# EAGLE design soccerbot (EAGLE 9.2.2)

## Sheet 1 of 5
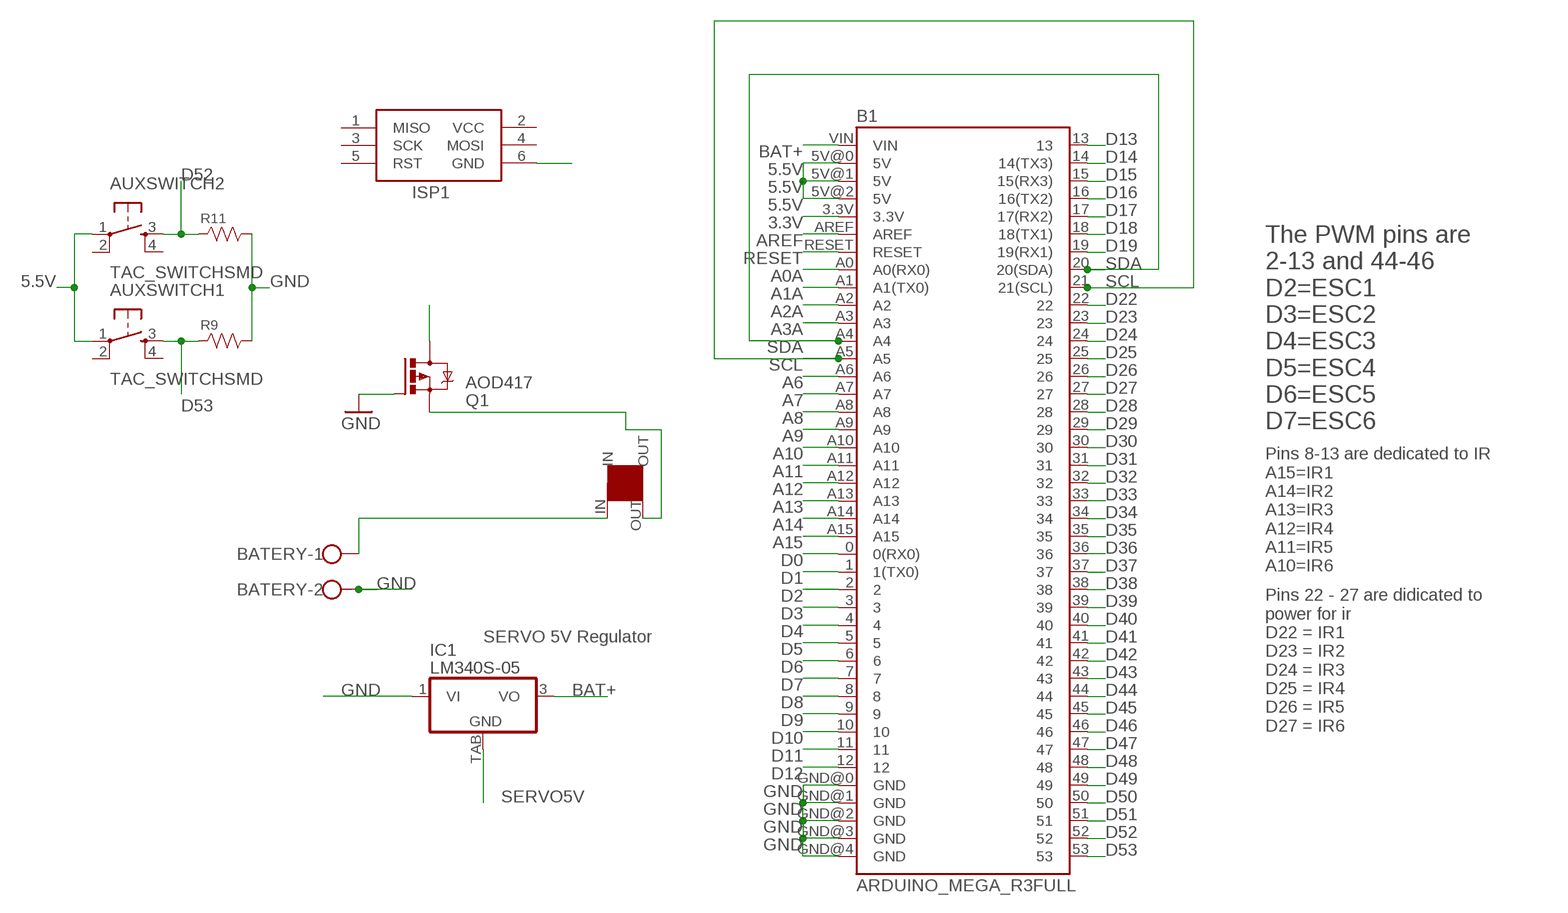
[diagram p0: schematic, sheet 1]

### Parts
AUXSWITCH1  TAC_SWITCHSMD  [TACTILE-SWITCH-SMD]
AUXSWITCH2  TAC_SWITCHSMD  [TACTILE-SWITCH-SMD]
B1  ARDUINO_MEGA_R3FULL  [ARDUINO_MEGA]
BATERY  W237-102  [W237-102]
IC1  LM340S-05  [TO263-3]
ISP1  AVRISP-6  [AVRISP]
Q1  AOD417  IRFR5305  [D-PAK_TO252AA]
R9  RESISTOR-0603  [0603]
R11  RESISTOR-0603  [0603]
U$2  TOGGLESWITCH  [TOGGLESWITCH]

### Nets
3.3V: B1.3.3V ; also sheet 2
5.5V: AUXSWITCH1.1 AUXSWITCH2.1 B1.5V@0(5V) B1.5V@1(5V) B1.5V@2(5V) ; also sheet 2,3,4
A0A: B1.A0(A0(RX0))
A1A: B1.A1(A1(TX0))
A2A: B1.A2
A3A: B1.A3
A6: B1.A6 ; also sheet 2
A7: B1.A7
A8: B1.A8 ; also sheet 2
A9: B1.A9
A10: B1.A10 ; also sheet 2
A11: B1.A11 ; also sheet 2
A12: B1.A12 ; also sheet 2
A13: B1.A13 ; also sheet 2
A14: B1.A14 ; also sheet 2
A15: B1.A15 ; also sheet 2
AREF: B1.AREF
BAT+ [hipower]: B1.VIN IC1.3(VO) Q1.4(D) ; also sheet 2,4
D0: B1.0(0(RX0))
D1: B1.1(1(TX0))
D2: B1.2 ; also sheet 4
D3: B1.3 ; also sheet 4
D4: B1.4 ; also sheet 4
D5: B1.5 ; also sheet 4
D6: B1.6 ; also sheet 4
D7: B1.7 ; also sheet 4
D8: B1.8
D9: B1.9
D10: B1.10
D11: B1.11
D12: B1.12
D13: B1.13
D14: B1.14(14(TX3))
D15: B1.15(15(RX3))
D16: B1.16(16(TX2))
D17: B1.17(17(RX2))
D18: B1.18(18(TX1))
D19: B1.19(19(RX1))
D22: B1.22
D23: B1.23
D24: B1.24
D25: B1.25
D26: B1.26
D27: B1.27
D28: B1.28
D29: B1.29
D30: B1.30
D31: B1.31
D32: B1.32
D33: B1.33
D34: B1.34
D35: B1.35
D36: B1.36
D37: B1.37
D38: B1.38
D39: B1.39
D40: B1.40
D41: B1.41
D42: B1.42
D43: B1.43
D44: B1.44
D45: B1.45
D46: B1.46
D47: B1.47
D48: B1.48
D49: B1.49
D50: B1.50
D51: B1.51
D52: AUXSWITCH2.3 B1.52 R11.1
D53: AUXSWITCH1.3 B1.53 R9.1
GND: B1.GND@0(GND) B1.GND@1(GND) B1.GND@2(GND) B1.GND@3(GND) B1.GND@4(GND) BATERY.2 IC1.1(VI) ISP1.6(GND) Q1.1(G) R9.2 R11.2 ; also sheet 2,3,4
N$4 [hipower]: BATERY.1 U$2.IN
N$5 [hipower]: Q1.3(S) U$2.OUT
RESET: B1.RESET
SCL: B1.21(21(SCL)) B1.A5 ; also sheet 2,3
SDA: B1.20(20(SDA)) B1.A4 ; also sheet 2,3
SERVO5V [lopower]: IC1.TAB(GND)
Unconnected: AUXSWITCH1.2 AUXSWITCH1.4 AUXSWITCH2.2 AUXSWITCH2.4 ISP1.1(MISO) ISP1.3(SCK) ISP1.4(MOSI) ISP1.5(RST)

### Notes on the sheet
- The PWM pins are
  2-13 and 44-46
  D2=ESC1
  D3=ESC2
  D4=ESC3
  D5=ESC4
  D6=ESC5
  D7=ESC6
- Pins 8-13 are dedicated to IR
  A15=IR1
  A14=IR2
  A13=IR3
  A12=IR4
  A11=IR5
  A10=IR6
- SERVO 5V Regulator
- Pins 22 - 27 are didicated to
  power for ir
  D22 = IR1
  D23 = IR2
  D24 = IR3
  D25 = IR4
  D26 = IR5
  D27 = IR6

## Sheet 2 of 5
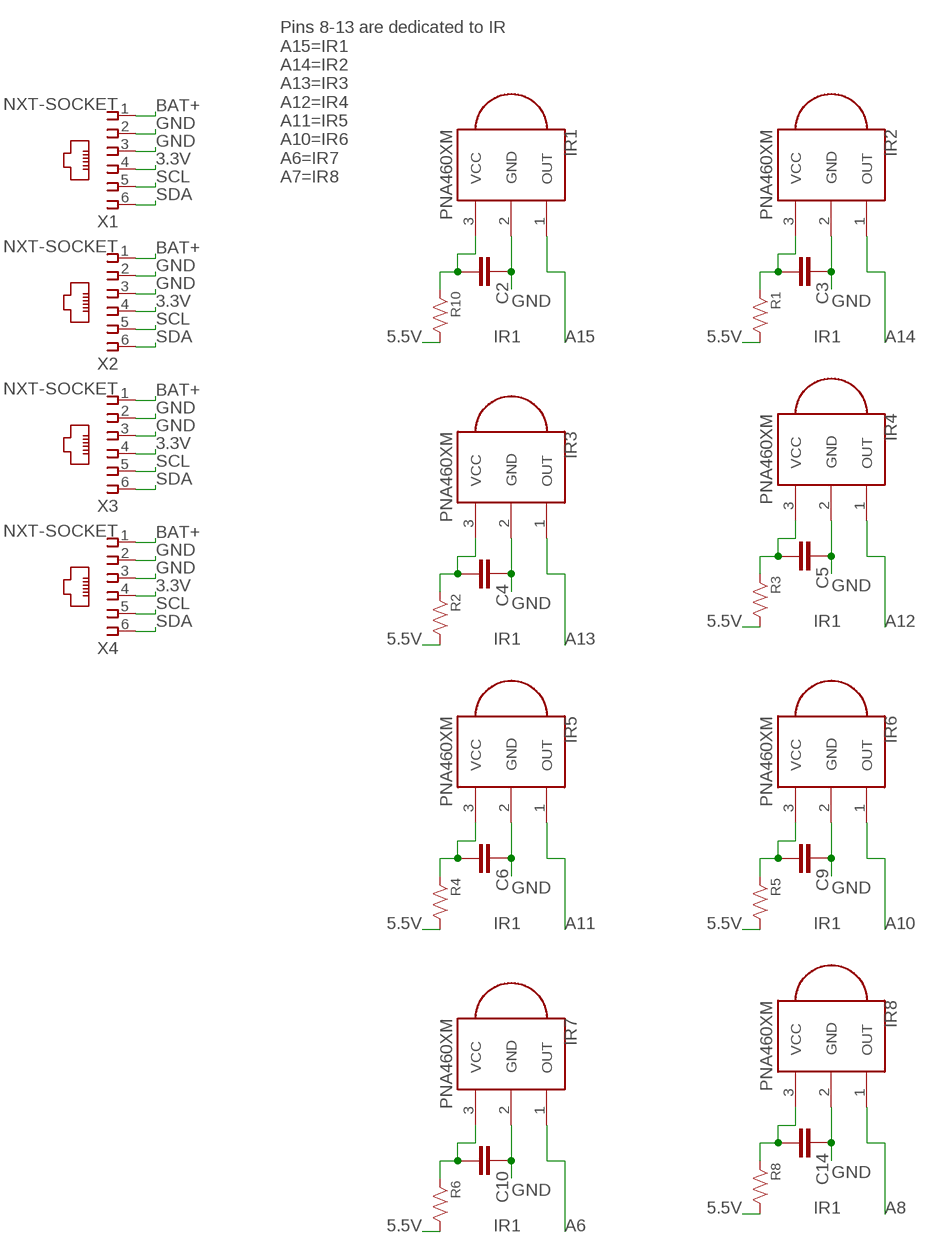
[diagram p1: schematic, sheet 2]

### Parts
C2  CAPACITOR  [C0603]
C3  CAPACITOR  [C0603]
C4  CAPACITOR  [C0603]
C5  CAPACITOR  [C0603]
C6  CAPACITOR  [C0603]
C9  CAPACITOR  [C0603]
C10  CAPACITOR  [C0603]
C14  CAPACITOR  [C0603]
IR1  PNA460XM  [PNA460XM]
IR2  PNA460XM  [PNA460XM]
IR3  PNA460XM  [PNA460XM]
IR4  PNA460XM  [PNA460XM]
IR5  PNA460XM  [PNA460XM]
IR6  PNA460XM  [PNA460XM]
IR7  PNA460XM  [PNA460XM]
IR8  PNA460XM  [PNA460XM]
R1  RESISTOR-0603-NARROW  [0603-NARROW]
R2  RESISTOR-0603-NARROW  [0603-NARROW]
R3  RESISTOR-0603-NARROW  [0603-NARROW]
R4  RESISTOR-0603-NARROW  [0603-NARROW]
R5  RESISTOR-0603-NARROW  [0603-NARROW]
R6  RESISTOR-0603-NARROW  [0603-NARROW]
R8  RESISTOR-0603-NARROW  [0603-NARROW]
R10  RESISTOR-0603-NARROW  [0603-NARROW]
X1  NXT-SOCKET  [NXT-SOCKET]
X2  NXT-SOCKET  [NXT-SOCKET]
X3  NXT-SOCKET  [NXT-SOCKET]
X4  NXT-SOCKET  [NXT-SOCKET]

### Nets
3.3V: X1.4 X2.4 X3.4 X4.4 ; also sheet 1
5.5V: R1.2 R2.2 R3.2 R4.2 R5.2 R6.2 R8.2 R10.2 ; also sheet 1,3,4
A6: IR7.1(OUT) ; also sheet 1
A8: IR8.1(OUT) ; also sheet 1
A10: IR6.1(OUT) ; also sheet 1
A11: IR5.1(OUT) ; also sheet 1
A12: IR4.1(OUT) ; also sheet 1
A13: IR3.1(OUT) ; also sheet 1
A14: IR2.1(OUT) ; also sheet 1
A15: IR1.1(OUT) ; also sheet 1
BAT+ [hipower]: X1.1 X2.1 X3.1 X4.1 ; also sheet 1,4
GND: C2.1 C3.1 C4.1 C5.1 C6.1 C9.1 C10.1 C14.1 IR1.2(GND) IR2.2(GND) IR3.2(GND) IR4.2(GND) IR5.2(GND) IR6.2(GND) IR7.2(GND) IR8.2(GND) X1.2 X1.3 X2.2 X2.3 X3.2 X3.3 X4.2 X4.3 ; also sheet 1,3,4
N$2: C3.2 IR2.3(VCC) R1.1
N$6: C2.2 IR1.3(VCC) R10.1
N$7: C4.2 IR3.3(VCC) R2.1
N$8: C5.2 IR4.3(VCC) R3.1
N$9: C6.2 IR5.3(VCC) R4.1
N$10: C9.2 IR6.3(VCC) R5.1
N$11: C10.2 IR7.3(VCC) R6.1
N$12: C14.2 IR8.3(VCC) R8.1
SCL: X1.5 X2.5 X3.5 X4.5 ; also sheet 1,3
SDA: X1.6 X2.6 X3.6 X4.6 ; also sheet 1,3

### Notes on the sheet
- Pins 8-13 are dedicated to IR
  A15=IR1
  A14=IR2
  A13=IR3
  A12=IR4
  A11=IR5
  A10=IR6
  A6=IR7
  A7=IR8
- IR1 | IR1
- IR1
- IR1
- IR1 | IR1
- IR1
- IR1

## Sheet 3 of 5
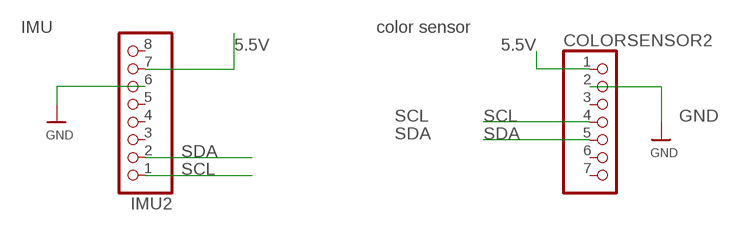
[diagram p2: schematic, sheet 3]

### Parts
COLORSENSOR2  HEADER-1X770MIL  [1X07_ROUND_70]
IMU2  HEADER-1X876MIL  [1X08_ROUND_76]

### Nets
5.5V: COLORSENSOR2.1 IMU2.7 ; also sheet 1,2,4
GND: COLORSENSOR2.2 IMU2.6 ; also sheet 1,2,4
SCL: COLORSENSOR2.4 IMU2.1 ; also sheet 1,2
SDA: COLORSENSOR2.5 IMU2.2 ; also sheet 1,2
Unconnected: COLORSENSOR2.3 COLORSENSOR2.6 COLORSENSOR2.7 IMU2.3 IMU2.4 IMU2.5 IMU2.8

### Notes on the sheet
- IMU | color sensor

## Sheet 4 of 5
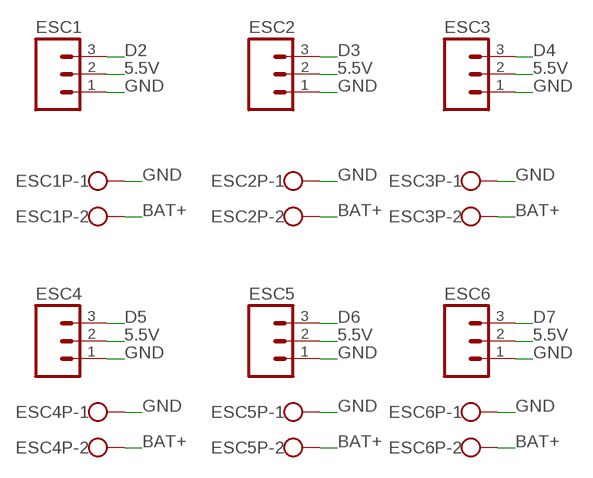
[diagram p3: schematic, sheet 4]

### Parts
ESC1  M03LOCK  [1X03_LOCK]
ESC1P  W237-102  [W237-102]
ESC2  M03LOCK  [1X03_LOCK]
ESC2P  W237-102  [W237-102]
ESC3  M03LOCK  [1X03_LOCK]
ESC3P  W237-102  [W237-102]
ESC4  M03LOCK  [1X03_LOCK]
ESC4P  W237-102  [W237-102]
ESC5  M03LOCK  [1X03_LOCK]
ESC5P  W237-102  [W237-102]
ESC6  M03LOCK  [1X03_LOCK]
ESC6P  W237-102  [W237-102]

### Nets
5.5V: ESC1.2 ESC2.2 ESC3.2 ESC4.2 ESC5.2 ESC6.2 ; also sheet 1,2,3
BAT+ [hipower]: ESC1P.2 ESC2P.2 ESC3P.2 ESC4P.2 ESC5P.2 ESC6P.2 ; also sheet 1,2
D2: ESC1.3 ; also sheet 1
D3: ESC2.3 ; also sheet 1
D4: ESC3.3 ; also sheet 1
D5: ESC4.3 ; also sheet 1
D6: ESC5.3 ; also sheet 1
D7: ESC6.3 ; also sheet 1
GND: ESC1.1 ESC1P.1 ESC2.1 ESC2P.1 ESC3.1 ESC3P.1 ESC4.1 ESC4P.1 ESC5.1 ESC5P.1 ESC6.1 ESC6P.1 ; also sheet 1,2,3

## Sheet 5 of 5
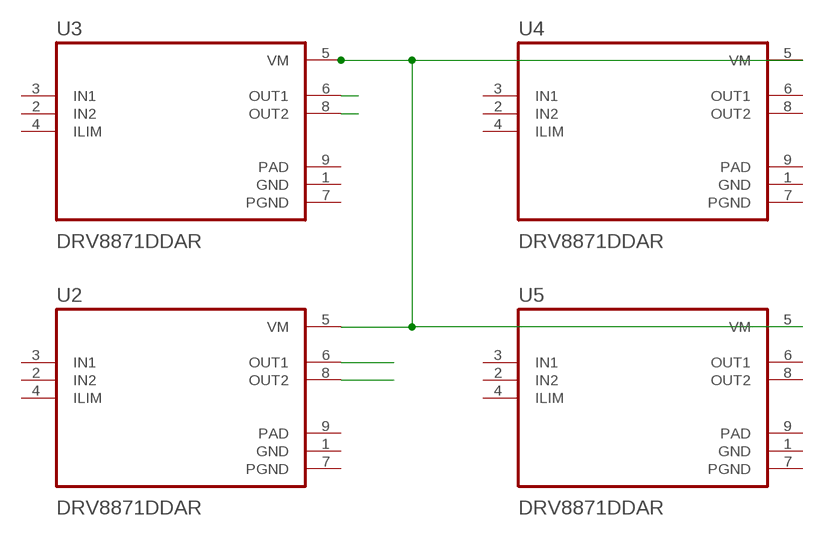
[diagram p4: schematic, sheet 5]

### Parts
U2  DRV8871DDAR  [SOIC127P600X170-8N]
U3  DRV8871DDAR  [SOIC127P600X170-8N]
U4  DRV8871DDAR  [SOIC127P600X170-8N]
U5  DRV8871DDAR  [SOIC127P600X170-8N]

### Nets
N$1: U2.5(VM) U3.5(VM) U4.5(VM) U5.5(VM)
N$3: U3.6(OUT1)
N$13: U3.8(OUT2)
N$15: U2.6(OUT1)
N$16: U2.8(OUT2)
Unconnected: U2.2(IN2) U2.3(IN1) U2.4(ILIM) U3.2(IN2) U3.3(IN1) U3.4(ILIM) U4.2(IN2) U4.3(IN1) U4.4(ILIM) U4.6(OUT1) U4.8(OUT2) U5.2(IN2) U5.3(IN1) U5.4(ILIM) U5.6(OUT1) U5.8(OUT2)

## Power pins joined to a net without a drawn wire
5.5V: ISP1.2(VCC)
GND: U2.1(GND) U3.1(GND) U4.1(GND) U5.1(GND)
PAD: U2.9(PAD) U3.9(PAD) U4.9(PAD) U5.9(PAD)
PGND: U2.7(PGND) U3.7(PGND) U4.7(PGND) U5.7(PGND)

## Library data of the parts
AUXSWITCH1 AUXSWITCH2 = SparkFun-Retired:TAC_SWITCH: Momentary Switch Button commonly used for reset or general input. Spark Fun Electronics SKU : COM-00097 SMT- SWCH-08247; PROD_ID: SWCH-08247
B1 = SparkFun-Boards:ARDUINO_MEGA_R3: Arduino Mega R3 ATmega2560 R3 compatible footprint. SparkFun Products: Arduino Mega 2560 R3 <https://www.sparkfun.com/products/11061>; OC_NEWARK: unknown
BATERY ESC1P ESC2P ESC3P ESC4P ESC5P ESC6P = con-wago-500:W237-102: WAGO SCREW CLAMP; MPN: MA522-500M02; OC_FARNELL: unknown; OC_NEWARK: 04R6830
C2-C6 C9 C10 C14 = BaseApp:CAPACITOR
COLORSENSOR2 = microbuilder:HEADER-1X7: PIN HEADER; OC_NEWARK: unknown
ESC1-ESC6 = SparkFun:M03: Header 3 Standard 3-pin 0.1" header. Use with straight break away headers (SKU : PRT-00116), right angle break away headers (PRT-00553), swiss pins (PRT-00743), machine pins (PRT-00117), and female headers (PRT-00115). Molex polarized connector foot print use with SKU : PRT-08232 with associated crimp pins and housings.; MF: MOLEX; MPN: 22-11-2032; OC_NEWARK: 81C8218
IC1 = linear:LM340?-*: Positive VOLTAGE REGULATOR Source: http://cache.national.com/ds/LM/LM340.pdf; MPN: LM1085ISX-5.0/NOPB; OC_NEWARK: 01AC5221
IMU2 = microbuilder:HEADER-1X8: PIN HEADER; OC_NEWARK: unknown
IR1-IR8 = adafruit:PNA460XM: IR 38KHz receiver PNA4602 and related receivers http://www.ladyada.net/library/pcb/eaglelibrary.html
ISP1 = adafruit:AVRISP: AVR ISP HEADER Standard 6 pin header for AVR programming; OC_NEWARK: unknown
Q1 = transistor-power:IRF?5305: HEXFET Power MOSFET Source: http://www.irf.com/product-info/datasheets/data/irfr5305pbf.pdf; MPN: AUIRFR540ZTRL; OC_NEWARK: 91Y4154
R1-R6 R8-R11 = FaBo-Resistors:RESISTOR: RESISTOR
U2-U5 = DRV8871DDAR:DRV8871DDAR: 3.6A Brushed DC Motor Driver with Integrated Current Sensing (PWM Ctrl) 8-SO PowerPAD -40 to 125; AVAILABILITY: Unavailable; DESCRIPTION: 3.6A Brushed DC Motor Driver with Integrated Current Sensing _PWM Ctrl_ 8-SO PowerPAD -40 to 125; MF: Texas Instruments; MP: DRV8871DDAR; PACKAGE: SO-8 Texas Instruments; PRICE: None
U$2 = toggleswitch:TOGGLESWITCH
X1-X4 = NXT Compatible (female) Sockets - Mindsensors:NXT-SOCKET: RJ11 6 connects Manufacturer: Mindsensors.com Source: NXT-Female-Socket.pdf; MPN: RJE01-660-01; OC_FARNELL: unknown; OC_NEWARK: 01M6133

## Net classes
0 default: width 0.508 mm, clearance 0.206 mm
1 hipower: width 1.651 mm, clearance 0.206 mm
2 lopower: width 0.762 mm, clearance 0.206 mm
3 signal: width 0.254 mm, clearance 0.206 mm

## Board
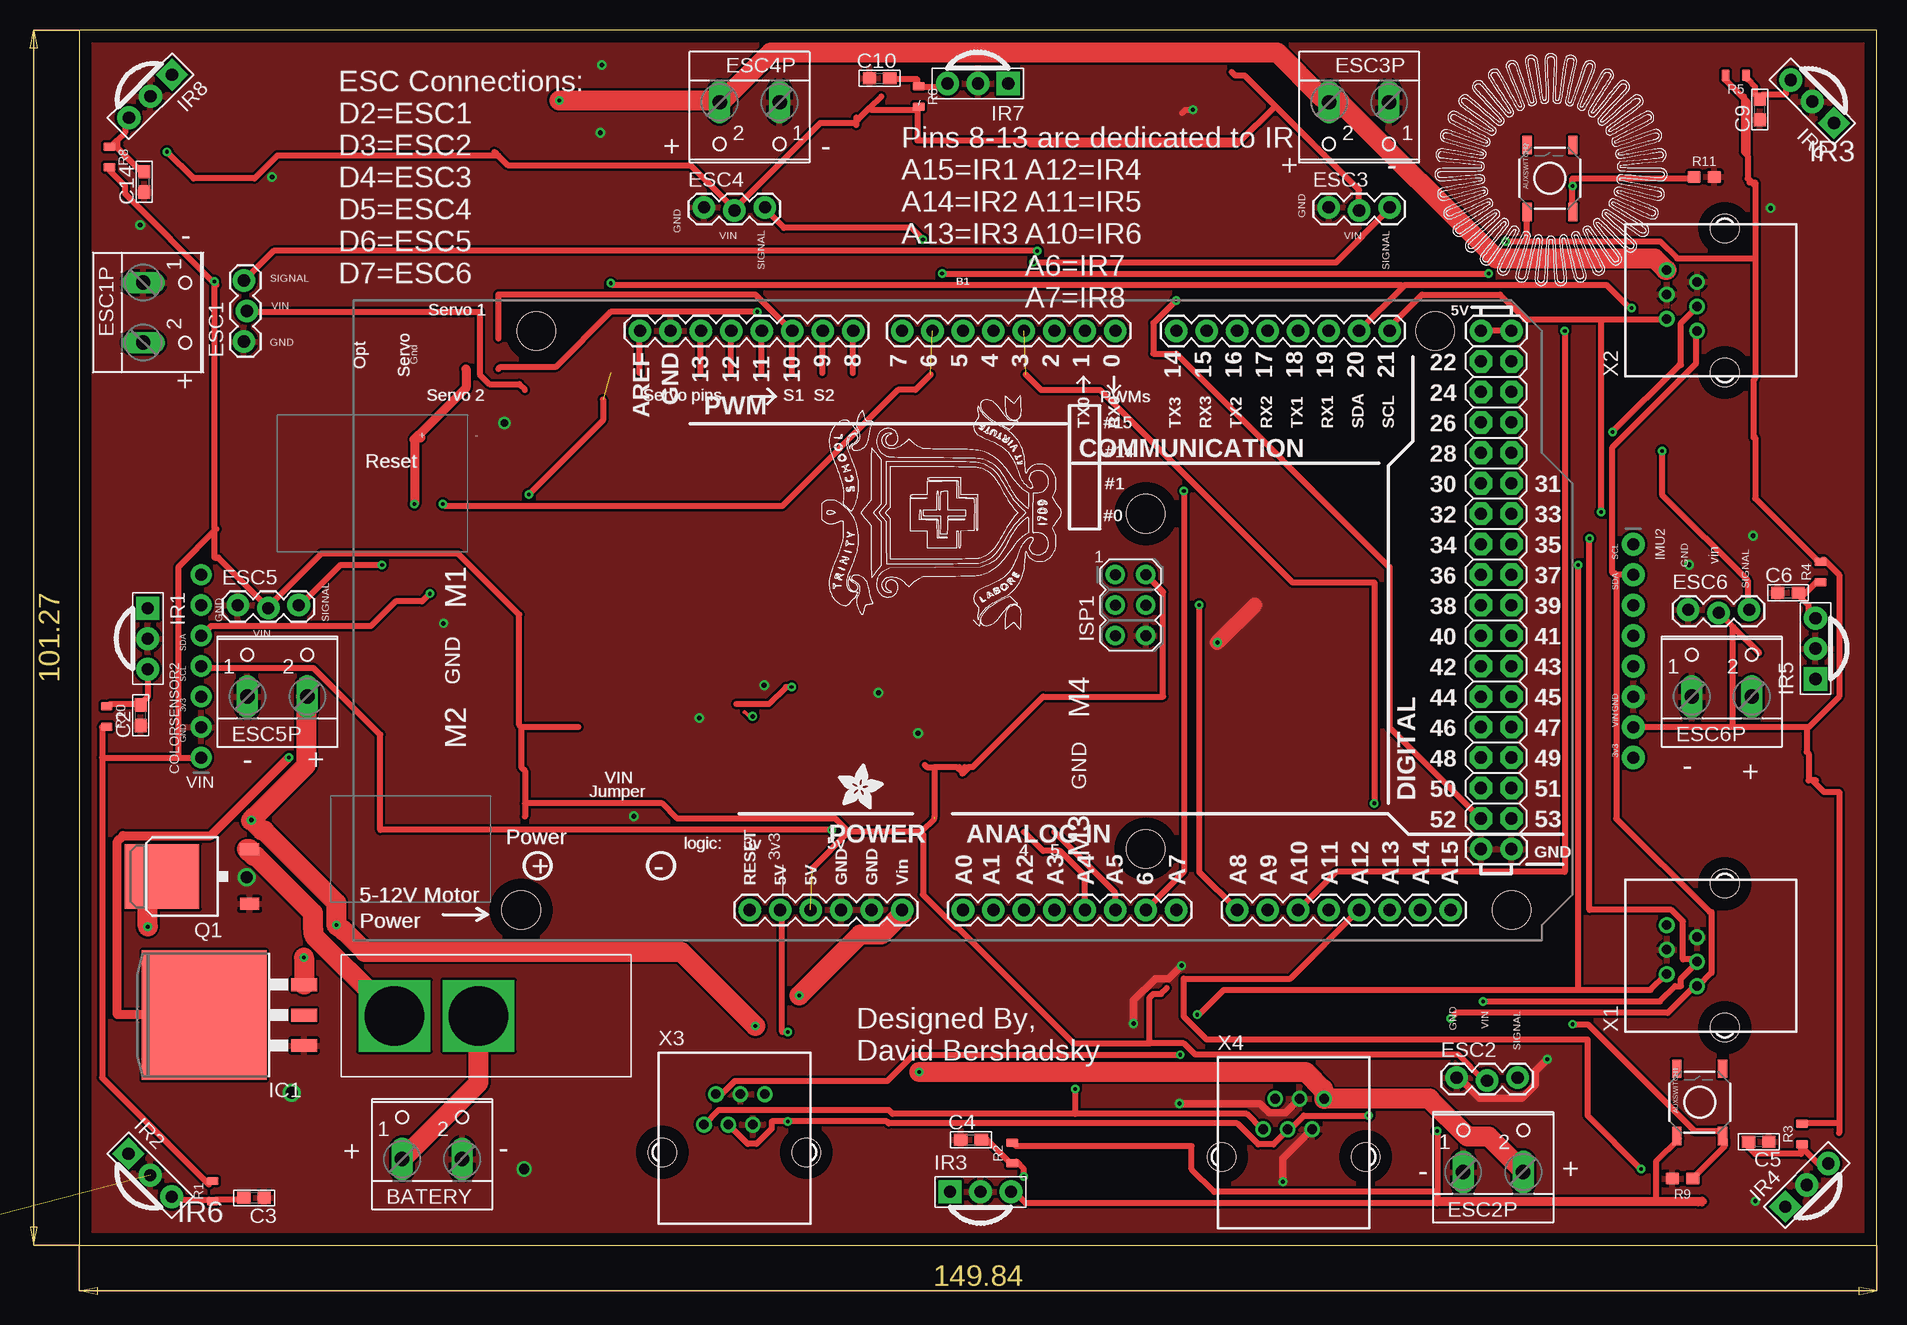
[diagram p5: board, top side]
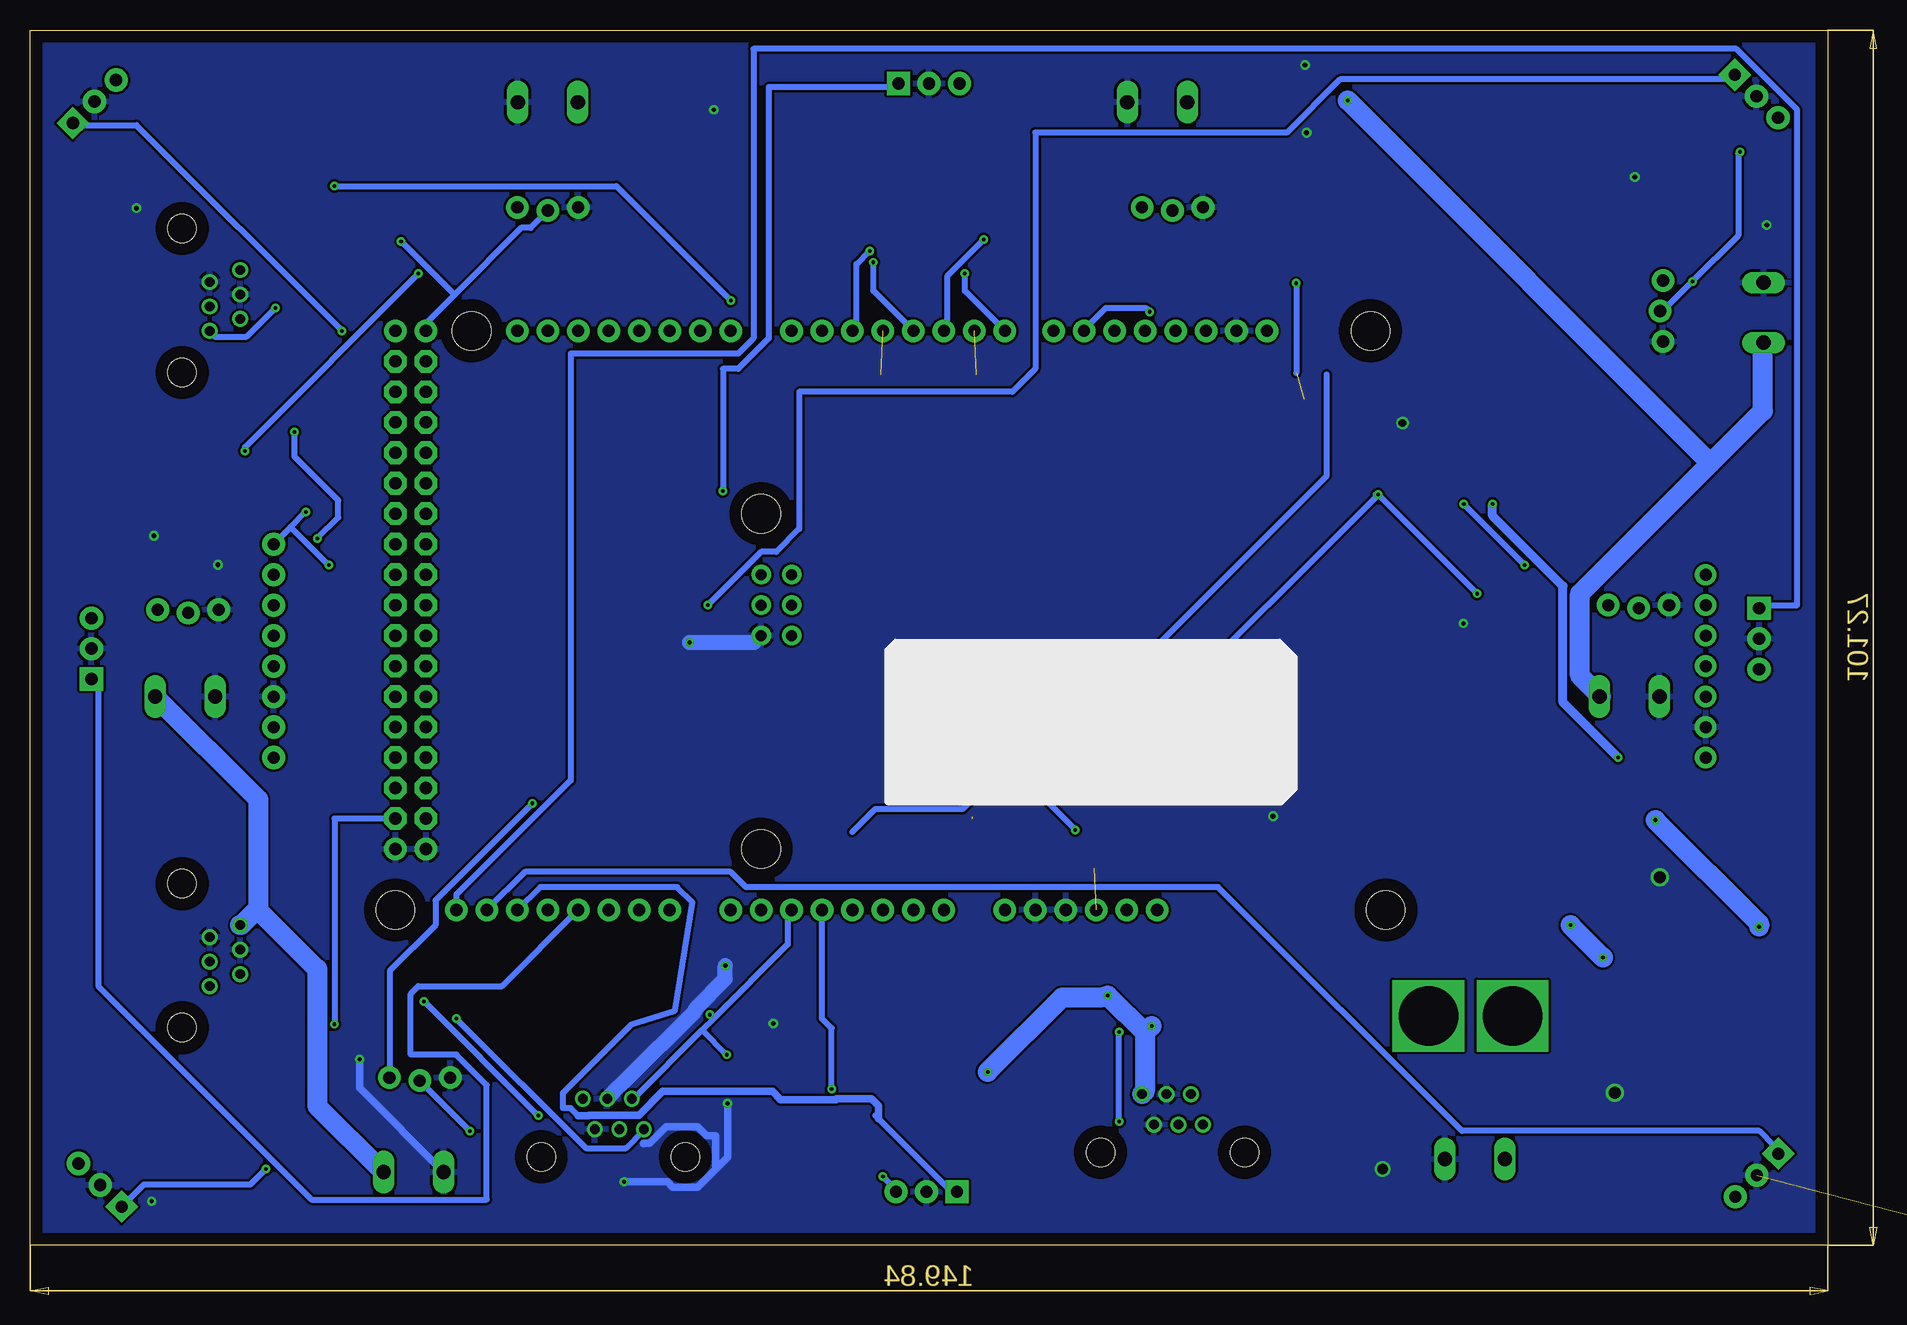
[diagram p6: board, bottom side, seen from below]

Size 149.84 x 101.27 mm. Coordinates in mm from the lower left corner, seen from the top.
Outline: 0,0 149.84,0 149.84,101.27 0,101.27 0,0
Copper layers (1*16): Top 0.035mm / dielectric 1.5mm / Bottom 0.035mm
Design rules "PcbWay *": minimum track width 6mil, minimum drill 0.3mm, track to track 0.205mm, track to pad 0.205mm, pad to pad 0.205mm, via to via 0.205mm, smd to smd 8mil, copper to edge 40mil, drill to drill 0.300228125mm, minimum pad ring 10mil, minimum via ring 8mil, stop-mask expansion 4mil, vias tented up to drill 25mil, thermal gap 10mil

### Footprints (pad centres in the part's own frame; a part is rotated, then mirrored left to right if it is on the bottom)
TACTILE-SWITCH-SMD = smd 1.524 x 0.762: 1 -2.794,1.905; 2 2.794,1.905; 3 -2.794,-1.905; 4 2.794,-1.905
ARDUINO_MEGA = drill 1.016 pad 1.88: 0 13.97,24.13; 1 11.43,24.13; 2 8.89,24.13; 3 6.35,24.13; 3.3V -13.97,-24.13; 4 3.81,24.13; 5 1.27,24.13; 5V@0 -11.43,-24.13; 5V@1 44.45,24.13; 5V@2 46.99,24.13; 6 -1.27,24.13; 7 -3.81,24.13; 8 -7.874,24.13; 9 -10.414,24.13; 10 -12.954,24.13; 11 -15.494,24.13; 12 -18.034,24.13; 13 -20.574,24.13; 14 19.05,24.13; 15 21.59,24.13; 16 24.13,24.13; 17 26.67,24.13; 18 29.21,24.13; 19 31.75,24.13; 20 34.29,24.13; 21 36.83,24.13; A0 1.27,-24.13; A1 3.81,-24.13; A2 6.35,-24.13; A3 8.89,-24.13; A4 11.43,-24.13; A5 13.97,-24.13; A6 16.51,-24.13; A7 19.05,-24.13; A8 24.13,-24.13; A9 26.67,-24.13; A10 29.21,-24.13; A11 31.75,-24.13; A12 34.29,-24.13; A13 36.83,-24.13; A14 39.37,-24.13; A15 41.91,-24.13; AREF -25.654,24.13; GND@0 -8.89,-24.13; GND@1 -6.35,-24.13; GND@2 44.45,-19.05; GND@3 46.99,-19.05; GND@4 -23.114,24.13; RESET -16.51,-24.13; VIN -3.81,-24.13 | drill 1.016 pad 1.88 octagon: 22 44.45,21.59; 23 46.99,21.59; 24 44.45,19.05; 25 46.99,19.05; 26 44.45,16.51; 27 46.99,16.51; 28 44.45,13.97; 29 46.99,13.97; 30 44.45,11.43; 31 46.99,11.43; 32 44.45,8.89; 33 46.99,8.89; 34 44.45,6.35; 35 46.99,6.35; 36 44.45,3.81; 37 46.99,3.81; 38 44.45,1.27; 39 46.99,1.27; 40 44.45,-1.27; 41 46.99,-1.27; 42 44.45,-3.81; 43 46.99,-3.81; 44 44.45,-6.35; 45 46.99,-6.35; 46 44.45,-8.89; 47 46.99,-8.89; 48 44.45,-11.43; 49 46.99,-11.43; 50 44.45,-13.97; 51 46.99,-13.97; 52 44.45,-16.51; 53 46.99,-16.51 | hole 3.2: -34.29,24.13; -35.56,-24.13; 16.51,8.89; 16.51,-19.05; 40.64,24.13; 46.99,-24.13
W237-102 = drill 1.194 long: 1 -2.5,-1.27; 2 2.5,-1.27
C0603 = smd 1.1 x 1: 1 -0.85,0; 2 0.85,0
1X07_ROUND_70 = drill 1 pad 1.778: 1 -7.62,0; 2 -5.08,0; 3 -2.54,0; 4 0,0; 5 2.54,0; 6 5.08,0; 7 7.62,0
1X03_LOCK = drill 1.016 pad 1.88: 1 0,0.127; 2 2.54,-0.127; 3 5.08,0.127
TO263-3 = smd 1.067 x 2.159: 1 -2.54,-5.791; 2 0,-5.791; 3 2.54,-5.791 | smd 10.8 x 10.41: TAB 0,2.54
1X08_ROUND_76 = drill 1 pad 1.93: 1 -8.89,0; 2 -6.35,0; 3 -3.81,0; 4 -1.27,0; 5 1.27,0; 6 3.81,0; 7 6.35,0; 8 8.89,0
PNA460XM = drill 1.016 pad 1.93 square: 1 -2.54,0 | drill 1.016 pad 1.93: 2 0,0; 3 2.54,0
AVRISP = drill 0.9 pad 1.626: 1 -1.27,2.54; 2 1.27,2.54; 3 -1.27,0; 4 1.27,0; 5 -1.27,-2.54; 6 1.27,-2.54
D-PAK_TO252AA = smd 1 x 1.6: 1 -2.28,-4.8; 3 2.28,-4.8 | smd 5.4 x 6.2: 4 0,2.5
0603-NARROW = smd 0.71 x 1: 1 -0.85,0; 2 0.85,0
0603 = smd 1.1 x 1: 1 -0.85,0; 2 0.85,0
SOIC127P600X170-8N = smd 1.97 x 0.6: 1 -2.475,1.905; 2 -2.475,0.635; 3 -2.475,-0.635; 4 -2.475,-1.905; 5 2.475,-1.905; 6 2.475,-0.635; 7 2.475,0.635; 8 2.475,1.905 | smd 2.02 x 2.87: 9 0,0
TOGGLESWITCH = drill 4.953 square: IN 0,0; OUT 0,-7.01
NXT-SOCKET = drill 0.8 pad 1.3: 1 2.54,4.84; 2 1.54,2.3; 3 0.5,4.84; 4 -0.5,2.3; 5 -1.54,4.84; 6 -2.54,2.3 | hole 2.36: -6,0; 6,0

### Placement (x,y rotation side)
AUXSWITCH1  135.06,11.91 90 top
AUXSWITCH2  122.59,88.9 90 top
B1  72.39,52.07 0 top
BATERY  29.4,8.45 0 top
C2  5.11,44.16 90 top
C3  14.57,3.94 180 top
C4  74.33,8.79 0 top
C5  139.99,8.64 180 top
C6  142.43,54.39 0 top
C9  140.08,94.65 90 top
C10  66.71,97.25 0 top
C14  5.4,88.61 90 top
COLORSENSOR2  10.16,48.26 90 top
ESC1  13.84,75.31 90 top
ESC1P  6.6,77.72 270 top
ESC2  114.81,13.84 0 top
ESC2P  117.86,7.37 0 top
ESC3  104.14,86.36 0 top
ESC3P  106.68,93.98 180 top
ESC4  52.07,86.36 0 top
ESC4P  55.88,93.98 180 top
ESC5  13.21,53.21 0 top
ESC5P  16.51,46.99 0 top
ESC6  134.11,52.83 0 top
ESC6P  136.91,46.99 0 top
IC1  12.95,19.18 90 top
IMU2  129.54,49.53 270 top
IR1  5.71,50.55 270 top
IR2  5.9,5.84 315 top
IR3  75.12,4.45 0 top
IR4  144,5.02 45 top
IR5  144.72,49.72 90 top
IR6  144.46,95.31 135 top
IR7  74.9,96.81 180 top
IR8  5.93,95.75 225 top
ISP1  87.63,53.34 0 top
Q1  9.4,30.73 90 top
R1  11.11,4.51 90 top
R2  77.76,7.68 90 top
R3  143.61,9.27 90 top
R4  145.13,56.1 90 top
R5  138.08,97.5 180 top
R6  69.98,95.73 270 top
R8  2.51,90.68 270 top
R9  133.64,5.56 180 top
R10  2.29,44.07 270 top
R11  135.45,89.03 0 top
U2  -10.73,-1.08 0 top  (outside the outline)
U3  -19.49,-1.08 0 top  (outside the outline)
U4  -28.26,-1.08 0 top  (outside the outline)
U5  -37.02,-1.08 0 top  (outside the outline)
U$2  33.27,19.11 270 top
U$17  [ADAFRUIT_TEXT_30MM]  77.98,38.1 0 bottom
U$18  [ADAFRUIT_3.5MM]  63.25,36.32 0 top
X1  137.16,24.13 90 top
X2  137.16,78.74 90 top
X3  54.61,7.75 0 top
X4  101.22,7.37 0 top

### Tracks (layer width: path | path; a pad name or v marks a point on that pad's centre or on a via)
3.3V  (via drill 0.3)
  Top 0.508: v117,20.32 131.76,20.32 133.03,21.59 133.51,21.59 133.51,22.23 134.78,23.5 X1.4 134.78,23.81 133.67,23.81 133.67,26.99 132.72,27.94 125.89,27.94 v125.89,58.9 | v107.47,10.79 102.08,10.79 100.97,9.68 X4.4 100.65,9.53 99.54,8.41 98.27,8.41 96.52,10.16 67.47,10.16 67.31,10.32 v59.05,10.32 57.72,10.32 57.72,9.72 56.45,8.45 55.71,8.45 X3.4 | v127.79,67.79 133.35,73.34 133.51,73.34 133.51,76.83 134.78,78.11 X2.4 | v59.05,17.78 58.58,17.78 58.58,27.78 B1.3.3V
  Bottom 0.508: v107.47,10.79 v117,20.32 | v127.79,67.79 127.79,65.72 124.14,62.07 124.14,60.64 v125.89,58.9 | v59.05,10.32 v59.05,17.78
5.5V  (via drill 0.3)  (2 unrouted)
  Top 0.152: 73.59,39.3 73.6,39.29
  Top 0.508: 139.06,90.81 139.06,88.9 139.7,88.27 | 139.06,90.81 138.75,91.12 138.75,95.73 | 139.7,88.27 139.7,88.58 139.22,88.58 | 139.7,88.27 139.7,82.23 | 139.7,82.23 139.7,72.23 139.54,72.07 139.54,67.31 139.7,67.31 139.7,62.23 144.78,57.15 R4.2 145.41,57.15 146.69,55.88 146.69,45.72 144.15,43.18 143.99,43.18 | B1.5V@2 B1.5V@1 | 96.04,97.79 96.36,97.47 97.16,97.47 99.69,94.93 | 99.69,94.93 106.68,87.95 ESC3.2 | 139.7,82.23 133.19,82.23 131.76,83.66 120.65,83.66 | v118.9,83.66 120.65,83.66 | 37.15,71.28 36.67,71.75 34.16,71.75 33.37,72.55 33.37,77.79 13.97,77.79 ESC1.2 | 66.83,95.73 65.88,94.77 | 65.88,94.77 64.93,93.82 64.77,93.98 64.77,93.5 | 64.77,93.5 61.75,93.5 54.61,86.36 ESC4.2 54.45,86.52 50.96,90.01 35.72,90.01 34.92,90.81 | v7.3,91.12 9.53,88.9 14.61,88.9 16.51,90.81 34.92,90.81 | 34.61,91.12 34.92,90.81 | 96.68,91.92 96.52,91.76 79.22,91.76 | 96.68,91.92 99.69,94.93 | 135.25,3.49 135.41,3.65 135.25,3.81 131.44,3.81 | 143.99,43.18 143.99,41.12 144.15,40.96 144.15,38.73 144.78,38.73 144.62,38.58 | 140.02,49.37 137.87,51.51 | 137.87,51.51 136.68,52.7 ESC6.2 | 143.99,43.18 137.79,43.18 | 137.79,43.18 IMU2.7 | 146.69,10.16 146.69,37.78 145.41,37.78 144.62,38.58 | 146.69,10.16 146.69,9.37 | 144.46,38.73 144.62,38.58 | 77.95,4.45 78.9,3.49 113.19,3.49 | 134.94,3.49 113.19,3.49 | 90.65,21.43 90.17,20.95 89.53,20.95 89.22,20.64 89.22,16.83 | 89.22,16.83 92.08,16.83 93.03,15.88 114.94,15.88 117,13.81 117.32,13.81 ESC2.2 | 37.15,36.83 37.15,39.53 36.83,39.85 36.83,43.18 | 37.15,36.83 37.15,35.72 | 41.59,43.18 36.83,43.18 | 71.28,39.85 70.64,39.85 70.48,40.01 | 73.15,39.85 73.34,39.85 | 73.15,39.85 71.28,39.85
  Top 0.508: 71.28,39.85 71.28,35.72 | ISP1.2 90.33,54.45 90.33,45.72 80.33,45.72 74.45,39.85 74.15,39.85 | 73.82,39.85 74.15,39.85 | 64.14,34.45 61.12,31.43 | 70.17,34.45 64.14,34.45 | 71.28,35.56 70.17,34.45 | 37.15,36.83 48.58,36.83 49.85,35.56 63.02,35.56 64.14,34.45 | 89.22,16.83 82.87,16.83 73.18,26.51 73.03,26.51 70.33,29.21 70.33,34.29 70.17,34.45 | 36.83,43.18 36.67,43.34 36.67,52.55 31.59,57.63 20.16,57.63 15.88,53.34 ESC5.2 15.72,53.18 11.59,57.31 11.27,57.31 11.27,59.69 | v113.19,9.53 113.19,4.45 | 113.19,4.45 113.19,3.81 | 113.19,3.81 113.19,3.49 | 11.27,59.69 v11.27,80.33 11.43,80.01 3.81,87.63 3.81,88.27 2.54,89.53 R8.2 | 74.15,39.85 73.6,39.29 73.6,39.4 73.15,39.85 | 113.19,3.81 131.44,3.81 | 113.03,3.81 113.19,3.81 | 64.77,93.34 64.77,93.5 | 146.69,10.16 143.51,10.16 R3.2 | 137.79,43.18 137.79,51.44 137.87,51.51 | 139.06,90.81 139.06,95.25 137.16,97.16 R5.2 | 120.65,83.66 120.65,85.72 AUXSWITCH2.1 | 1.91,40.64 1.91,43.18 R10.2 | 1.91,40.64 1.91,13.97 10.79,5.08 R1.2 | 1.91,40.64 8.26,40.64 | 8.26,40.64 COLORSENSOR2.1 | 113.19,4.45 94.61,4.45 92.71,6.35 92.71,8.26 78.11,8.26 R2.2 | 69.85,94.61 66.04,94.61 65.88,94.77 | 131.44,3.81 131.44,6.99 133.35,8.89 AUXSWITCH1.1 | 8.26,40.64 8.26,56.52 11.43,59.69 11.27,59.69 | 69.85,94.61 69.85,92.08 96.52,92.08 96.68,91.92 | 69.85,94.61 R6.2
  Bottom 0.508: B1.5V@1 116.84,76.83 114.46,79.22 | 114.46,79.22 108.9,84.77 108.11,84.77 106.68,86.2 ESC3.2 | 114.46,79.22 v118.9,83.66 | ESC1.2 13.97,77.95 13.65,77.95 v11.27,80.33 7.46,84.14 7.46,90.96 v7.3,91.12 | v113.19,9.53 117.32,13.65 ESC2.2
A6  (via drill 0.3)
  Top 0.508: B1.A6 92.08,31.11 v92.08,62.87
  Bottom 0.508: v92.08,62.87 92.08,73.03 90.81,73.03 88.27,75.56 88.27,96.52 77.47,96.52 IR7.1
A8  (via drill 0.3)
  Top 0.508: B1.A8 93.34,31.11 v93.34,53.34
  Bottom 0.508: v93.34,53.34 88.9,57.78 87.63,57.78 85.72,59.69 85.72,71.12 67.94,71.12 66.04,73.03 66.04,92.71 45.09,92.71 40.64,97.16 8.26,97.16 IR8.1
A10  (via drill 0.3)
  Top 0.508: B1.A10 104.78,31.11 123.83,31.11 v123.83,76.2
  Bottom 0.508: v123.83,76.2 140.97,93.34 146.05,93.34 IR6.1
A11
  Bottom 0.508: B1.A11 110.49,21.59 117.47,21.59 118.11,20.95 118.11,15.88 114.3,15.88 111.76,13.34 111.76,3.81 126.36,3.81 144.15,21.59 144.15,46.99 IR5.1
A12  (via drill 0.3)
  Top 0.508: B1.A12 100.97,22.23 92.08,22.23 92.08,19.05 93.98,17.14 125.73,17.14 125.73,10.79 v130.18,6.35
  Bottom 0.508: v130.18,6.35 131.44,5.08 140.34,5.08 141.6,3.81 IR4.1
A13
  Bottom 0.508: B1.A13 107.31,29.84 95.89,29.84 94.61,28.57 96.08,19.56 99.69,18.41 105.41,12.7 105.41,11.43 104.78,11.43 104.14,10.79 | 79.38,10.79 79.12,10.54 73.03,4.45 IR3.1
  Bottom 0.635: 79.12,10.54 79.12,11.62 79.69,12.19 82.61,12.19 82.66,12.14 87.26,12.14 87.95,12.83 97.09,12.83 99.08,10.84 103.25,10.84 103.3,10.79 104.14,10.79
A14
  Bottom 0.508: B1.A14 108.58,31.11 91.44,31.11 90.17,29.84 50.8,29.84 30.48,9.53 5.71,9.53 4.45,8.26 IR2.1
A15
  Bottom 0.508: B1.A15 114.3,29.21 104.78,38.73 104.78,74.3 90.81,74.3 89.53,75.56 89.53,99.69 7.62,99.69 2.54,94.61 2.54,53.34 5.71,53.34 IR1.1
AREF
  Top 0.508: 46.67,72.71 46.67,76.2 B1.AREF
BAT+  (via drill 0.3, 0.35)
  Top 1.651: X2.1 132.24,81.28 131.29,82.23 118.11,82.23 105.09,95.25 ESC3P.2 103.5,95.73 99.85,99.38 57.63,99.38 53.5,95.25 ESC4P.2 52.7,95.41 v40.01,95.41 | 103.82,12.22 112.55,12.22 115.73,9.05 117.47,9.05 120.33,6.19 ESC2P.2 | 103.82,12.22 X4.1 | v60.01,20.8 65.09,25.88 66.83,25.88 68.58,27.62 B1.VIN | 14.53,35.64 18.89,40.01 18.89,45.72 ESC5P.2 | 14.53,35.64 14.29,35.4 | v18.73,23.97 18.73,21.75 IC1.3 | v56.36,18.26 50.16,24.45 23.81,24.45 22.07,26.19 v21.43,26.67 21.43,28.54 15.43,34.55 15.24,34.55 v14.35,35.43 14.61,35.56 14.53,35.64 | v70.01,14.45 102.23,14.45 103.66,13.02 103.82,12.22 | v5.71,26.54 5.71,29.55 Q1.4
  Bottom 1.651: 130.89,28.02 130.81,28.1 130.81,37.15 139.38,45.72 ESC6P.2 | 130.89,28.02 132.24,26.67 X1.1 | 130.89,28.02 125.89,23.02 125.89,11.59 120.49,6.19 ESC2P.2 | 56.91,17.7 v60.01,20.8 60.8,20.64 63.82,20.64 v70.01,14.45 | v21.43,26.67 v18.73,23.97 | 9.76,65.17 20.64,54.29 20.64,47.47 18.89,45.72 ESC5P.2 | 9.76,65.17 5.4,69.53 5.4,75.09 ESC1P.2 | v56.36,18.26 56.91,17.7 | 9.76,65.17 v40.01,95.41 | 56.91,17.7 56.91,12.82 X3.1 | v14.35,35.43 5.71,26.8 v5.71,26.54
D2  (via drill 0.3)
  Top 0.508: ESC1.3 16.19,82.87 v79.85,82.87
  Bottom 0.508: v79.85,82.87 80.96,81.76 80.96,76.52 B1.2
D3  (via drill 0.3)  (1 unrouted)
  Top 0.508: v107.95,36.83 107.95,55.24 101.12,55.24 85.09,71.28 80.17,71.28 78.9,72.55
  Bottom 0.508: v107.95,36.83 116.05,28.73 116.05,26.67 119.86,22.86 119.86,13.97 ESC2.3
D4  (via drill 0.3)
  Top 0.508: v79.53,81.92 104.78,81.92 109.22,86.36 ESC3.3
  Bottom 0.508: v79.53,81.92 79.53,79.53 B1.4
D5  (via drill 0.3)
  Top 0.508: v70.33,83.82 69.37,84.77 58.74,84.77 57.15,86.36 ESC4.3
  Bottom 0.508: v70.33,83.82 73.34,80.8 73.34,76.52 B1.5
D6  (via drill 0.3)  (1 unrouted)
  Top 0.508: v25.24,56.67 21.75,56.67 18.41,53.34 ESC5.3 | v30.32,61.75 30.48,61.59 58.58,61.59 68.26,71.28 69.69,71.28 70.96,72.55
  Bottom 0.508: v30.32,61.75 v25.24,56.67
D7  (via drill 0.3)
  Top 0.508: v131.92,66.2 131.92,62.55 139.06,55.4 139.06,53.02 ESC6.3 | v71.91,80.96 v117.47,80.96
  Bottom 0.508: v131.92,66.2 131.92,66.52 v117.47,80.96 | v71.91,80.96 71.91,79.53 B1.7
D8
  Top 0.508: 64.45,72.71 64.45,76.2 B1.8
D9  (via drill 0.3)
  Top 0.508: 34.92,73.03 35.08,73.18 39.69,73.18 44.29,77.79 v56.52,77.79 | 61.91,72.71 61.91,76.2 B1.9
  Bottom 0.508: v56.52,77.79 56.83,78.11 60.17,78.11 62.07,76.2 B1.9
D10
  Top 0.508: 34.92,75.56 34.92,79.22 56.36,79.22 59.37,76.2 B1.10 59.37,76.04 59.37,72.71
D11
  Top 0.508: 56.83,72.71 56.83,76.2 B1.11
D12
  Top 0.508: 54.29,72.71 54.29,76.2 B1.12
D13
  Top 0.508: 51.75,72.71 51.75,76.2 B1.13
D52  (via drill 0.3)
  Top 0.508: R11.1 134.62,88.9 124.46,88.9 v124.46,88.27 124.46,86.36 AUXSWITCH2.3 | B1.52 109.22,43.18 109.22,56.52 91.44,74.3 89.53,74.3 89.53,76.83 v91.44,78.74
  Bottom 0.508: v91.44,78.74 100.97,88.27 v124.46,88.27
D53  (via drill 0.3)
  Top 0.508: R9.1 134.62,5.71 137.16,8.26 137.16,8.89 AUXSWITCH1.3 137.16,9.53 134.62,9.53 125.73,18.41 v124.46,18.41
  Bottom 0.508: v124.46,18.41 124.46,35.56 B1.53
GND  (via drill 0.35, 0.4, 0.65, 0.85, 1)  (4 unrouted)
  Top 0.508: 91.95,94.36 92.2,94.61 v92.84,94.61
  Top 0.635: v91.89,23.3 90.79,22.21 89.69,22.21 87.88,20.4 v87.88,18.48 | X4.2 100.33,7.24 v100.33,5.28 | v91.69,11.81 98.41,11.81 99.19,11.03 100.54,11.03 X4.3 | ESC2.1 115.03,13.97 116.74,12.25 120.24,12.25 121.35,13.36 121.35,14.48 v122.36,15.49
  Top 1.27: 97.98,53.34 v94.87,50.23
  Bottom 0.635: v100.33,5.28 96.69,5.28 96.26,4.85 94.18,4.85 92.71,6.33 | 92.71,6.33 92.71,8.41 92.71,9.14 93.44,9.14 94.18,9.88 96.8,9.88 98.19,8.49 98.68,8.49 98.7,8.47 | 92.71,6.33 91.69,7.34 v91.69,11.81 | ESC2P.1 122.36,13.1 v122.36,15.49
  Bottom 1.27: v94.87,50.23 89.47,50.23 ISP1.6 | X4.3 101.17,12.75 101.17,12.82 100.3,13.7 100.22,13.7 94.38,19.55 94.38,19.7 91.89,22.2 v91.89,23.3
  other vias: 30.35,51.82 139.7,3.68 17.72,12.7 13.97,30.67 69.91,42.67 66.61,46.04 51.69,43.94 134.18,56.71 139.51,59.12 5.08,85.03 16.07,89.03 140.97,86.42 46.23,35.75 57.09,46.67 43.56,98.36 43.43,92.71 35.43,68.52 37.08,6.35
  pour Top: 0.25,100.84 149.61,100.84 149.61,0.25 0.25,0.25
  pour Bottom: 0.76,100.84 149.48,100.84 149.48,0.51 0.76,0.51
N$1  (3 unrouted)
N$2
  Top 0.508: C3.2 13.34,3.81 11.43,3.81 R1.1 10.79,3.81 8.26,3.81 IR2.3
N$4
  Top 1.651: BATERY.1 33.27,13.55 U$2.IN
N$5
  Top 1.651: U$2.OUT 26.26,19.37 25.12,20.23 19.6,25.75 19.48,26.53 19.48,27.68 14.71,32.45 14.54,32.45 13.97,33.02 | 13.97,33.02 14.14,33.02 | 13.97,33.02 Q1.3
N$6
  Top 0.508: 5.08,45.09 2.54,45.09 R10.1 | 5.08,45.09 5.71,45.72 IR1.3 | 5.08,45.09 C2.2
N$7  (via drill 0.3)
  Top 0.508: C4.2 75.56,8.89 77.47,6.99 R2.1 78.11,6.99 78.74,6.35 v78.74,5.71
  Bottom 0.508: v78.74,5.71 77.47,4.45 IR3.3
N$8
  Top 0.508: 143.51,8.26 145.41,6.35 IR4.3 | 143.51,8.26 143.51,7.62 139.7,7.62 139.06,8.26 C5.2 | 143.51,8.26 R3.1
N$9
  Top 0.508: 143.51,53.98 144.78,55.24 R4.1 | 143.51,53.98 144.15,53.34 144.15,52.7 IR5.3 | 143.51,53.98 C6.2
N$10
  Top 0.508: R5.1 139.06,97.16 139.7,96.52 139.7,95.89 C9.2 140.34,95.89 142.24,95.89 142.24,96.52 IR6.3
N$11
  Top 0.508: 69.85,96.52 71.75,96.52 IR7.3 | 69.85,96.52 69.85,97.16 67.94,97.16 C10.2 | 69.85,96.52 R6.1
N$12
  Top 0.508: 3.17,92.08 3.81,92.71 3.81,93.34 IR8.3 | 3.17,92.08 2.54,91.44 R8.1 | 3.17,92.08 3.17,91.44 5.08,89.53 C14.2
PAD  (3 unrouted)
PGND  (3 unrouted)
SCL  (via drill 0.3)  (1 unrouted)
  Top 0.508: 54.77,45.09 57.47,45.09 58.9,46.51 v59.37,46.51 | COLORSENSOR2.4 10.32,48.1 19.53,48.1 25.08,42.55 25.08,34.61 v62.71,34.61 | 126.84,77.15 120.49,77.15 118.43,79.22 111.92,79.22 109.22,76.52 B1.21 | 126.84,77.15 132.24,77.15 X2.5 | 126.84,77.15 v126.84,61.12 | v91.76,15.88 69.53,15.88 67.36,13.7 54.65,13.7 53.53,12.59 X3.5 | 124.94,21.27 95.41,21.27 93.34,19.21 v93.19,19.21 | 124.94,21.27 130.97,21.27 132.24,22.54 X1.5 | 124.94,21.27 v124.94,56.67 | 81.28,34.45 86.36,29.37 B1.A5
  Bottom 0.508: 68.26,40.16 72.07,36.35 79.38,36.35 81.28,34.45 | 68.26,40.16 61.91,46.51 v59.37,46.51 41.75,64.14 41.75,72.55 | 68.26,40.16 v62.71,34.61 | v126.84,61.12 128.11,59.85 | 128.11,59.85 IMU2.1 | 92.87,18.89 86.68,25.08 86.68,27.62 B1.A5 | 92.87,18.89 93.82,17.94 | 93.82,17.94 99.54,12.22 X4.5 | 93.82,17.94 v91.76,15.88 | v93.19,19.21 92.87,18.89 | v124.94,56.67 128.11,59.85
SDA  (via drill 0.3, 0.35)  (1 unrouted)
  Top 0.305: v56.13,44.07 55.82,44.07 55.44,44.45 55.42,44.43
  Top 0.508: 78.74,34.45 80.33,32.86 81.76,32.86 83.82,30.8 B1.A4 | 83.03,10.95 97.31,10.95 98.58,9.68 X4.6 | 83.03,10.95 67.79,10.95 67.47,11.27 53.29,11.27 X3.6 | 83.03,10.95 v83.03,13.02 | COLORSENSOR2.5 10.95,51.59 24.29,51.59 26.35,53.66 28.57,53.66 v29.21,54.29 | v37.47,62.55 43.66,68.74 43.66,70.48 | 128.11,55.88 128.11,35.56 135.89,27.78 136.05,27.78 136.05,22.7 134.94,21.59 X1.6 134.62,21.59 132.4,19.37 114.78,19.37 v114.3,18.89 | IMU2.2 128.11,55.88 | X2.6 134.78,76.2 134.78,73.5 127.79,66.52 127.79,56.04 127.95,56.04 128.11,55.88 | 110.33,79.85 110.49,80.01 127.32,80.01 129.22,78.11 v129.38,78.11 | 110.33,79.85 B1.20 | v44.29,80.17 44.45,80.01 110.17,80.01 110.33,79.85
  Bottom 0.508: B1.A4 83.82,18.89 83.03,18.1 v83.03,13.02 | v29.21,54.29 v37.47,62.55 | v129.38,78.11 131.76,75.72 134.46,75.72 134.94,76.2 X2.6 | v44.29,80.17 44.29,72.71 | v114.3,18.89 103.5,8.1 100.17,8.1 98.74,9.53 X4.6 | 37.66,62.55 v37.47,62.55 | v37.47,62.55 55.94,44.07 v56.13,44.07
SERVO5V  (via drill 0.3)
  Top 0.762: 28.26,67.47 32.23,71.44 32.23,73.03 | 27.94,67.15 v27.94,61.75 | v17.46,40.64 10.95,34.13 3.65,34.13 3.17,33.66 3.17,19.21 10.32,19.21 IC1.TAB
  Top 0.813: 28.42,67.31 28.26,67.47 27.94,67.15
  Bottom 0.762: v27.94,61.75 27.94,60.8 22.07,54.93 22.07,45.24 v17.46,40.64

### Text on the board
tPlace: + | - | IR3 | + | - | - | Servo 1 | Servo 1 | Opt | Opt | Servo | Servo | Gnd | + | Servo 2 | Servo 2 | Servo pins | Servo pins | S1 | S1 | S2 | S2 | PWMs | PWMs | #15 | #15 | + | - | Reset | Reset | #14 | #14 | #1 | #1 | #0 | #0 | vin | M1 | M1 | GND | GND | M4 | M2 | M2 | - | + | - | + | VIN | VIN | GND | Jumper | Jumper | Power | Power | logic: | logic: | 3v | 3v | 5v | 5v | 4 | 4 | 5 | 5 | M3 | M3 | + | + | - | - | 5-12V Motor | 5-12V Motor | Power | Power | + | - | + | - | IR6
tNames: GND | GND | VIN | VIN | SIGNAL | Pins 8-13 are dedicated to IR / A15=IR1 / A14=IR2 / A13=IR3 | SIGNAL | SIGNAL | VIN | A12=IR4 / A11=IR5 / A10=IR6 / A6=IR7 / A7=IR8 | ESC Connections: / D2=ESC1 / D3=ESC2 / D4=ESC3 / D5=ESC4 / D6=ESC5 / D7=ESC6 | GND | SCL | GND | SDA | SIGNAL | GND | SIGNAL | VIN | SDA | SCL | 3v3 | GND | VIN | GND | 3v3 | VIN | ___ 3v3 | GND | VIN | SIGNAL | Designed By, / David Bershadsky